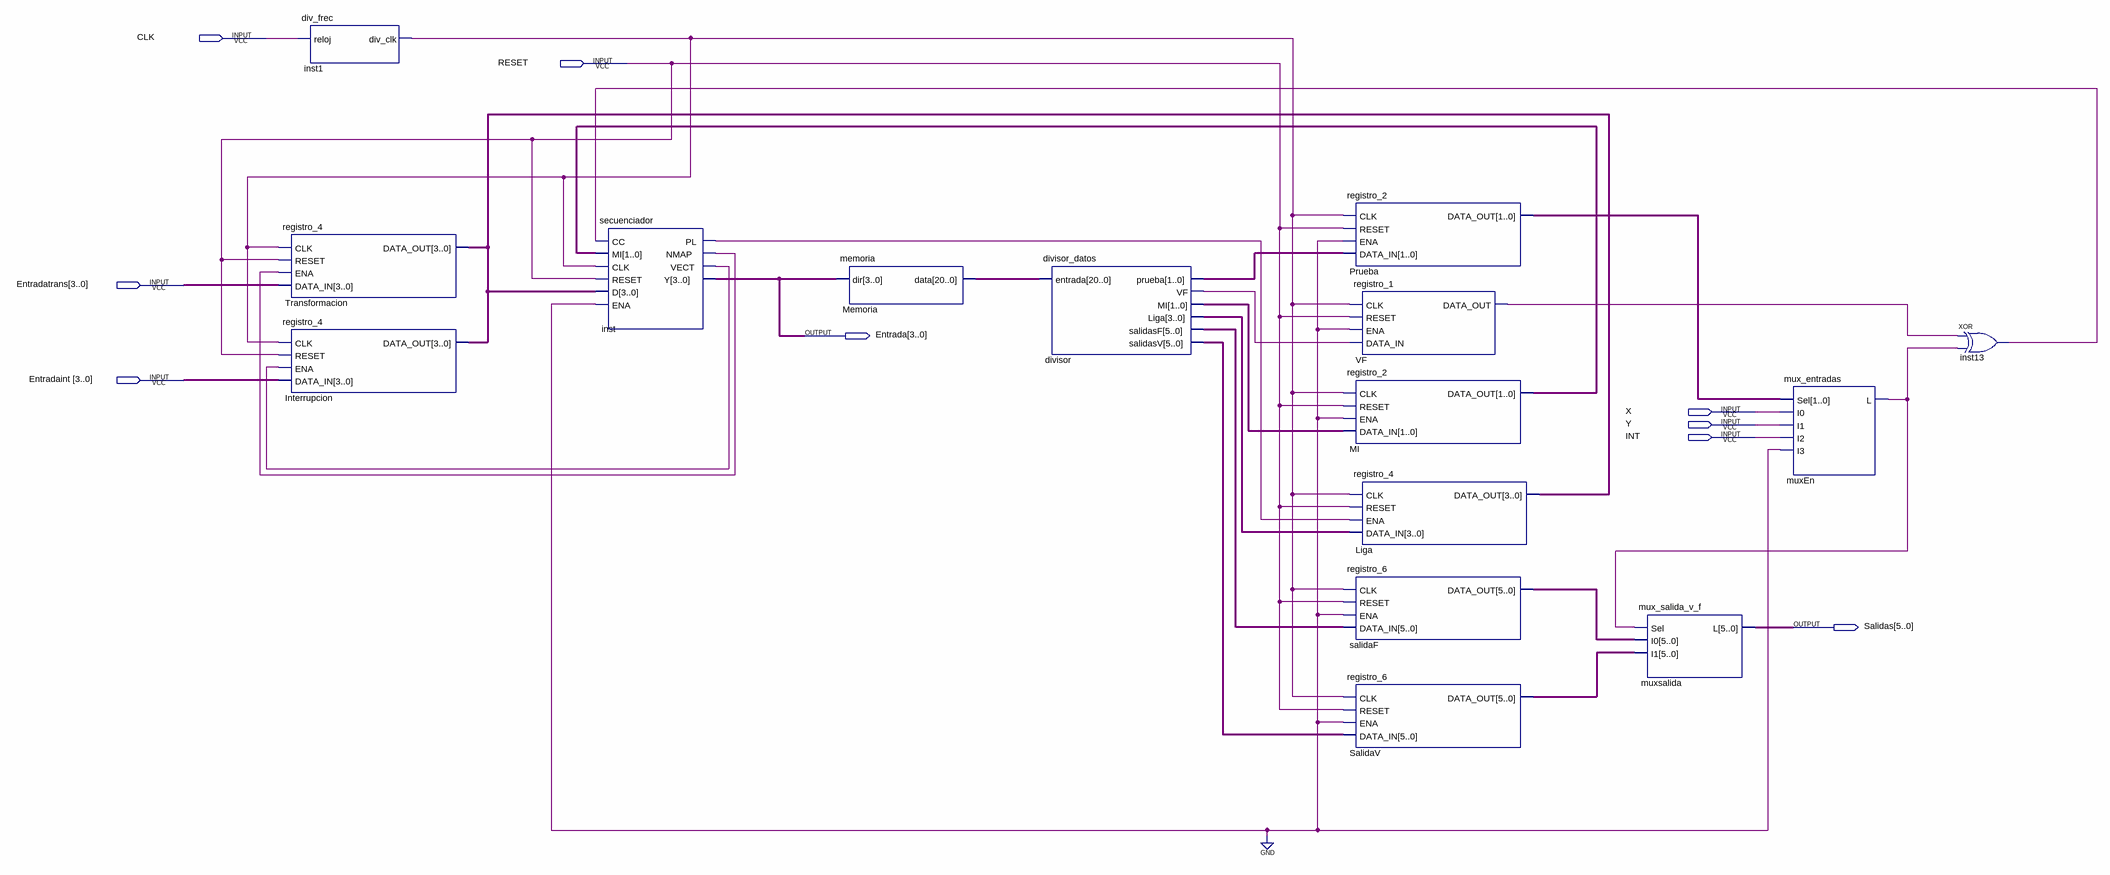
[diagram p0: schematic sheet]
// Quartus schematic Practica6.bdf as structural Verilog: 15 symbols, 9 pins
module Practica6 (
  input  CLK,
  input  RESET,
  input  [3:0] Entradatrans,
  input  [3:0] Entradaint,
  input  X,
  input  Y,
  input  INT,
  output [3:0] Entrada,
  output [5:0] Salidas
);

  wire divisor_vf, inst1_div_clk, inst13_out, inst_nmap, inst_pl, inst_vect, muxEn_l, VF_data_out;
  wire [1:0] divisor_mi, divisor_prueba, MI_data_out, Prueba_data_out;
  wire [3:0] divisor_liga, Transformacion_data_out;
  wire [5:0] divisor_salidasf, divisor_salidasv, salidaF_data_out, SalidaV_data_out;
  wire [20:0] Memoria_data;

  registro_4 Transformacion (
    .CLK(inst1_div_clk), .RESET(RESET), .ENA(inst_nmap), .DATA_IN(Entradatrans),
    .DATA_OUT(Transformacion_data_out));
  registro_4 Interrupcion (
    .CLK(inst1_div_clk), .RESET(RESET), .ENA(inst_vect), .DATA_IN(Entradaint),
    .DATA_OUT(Transformacion_data_out));
  div_frec inst1 (.reloj(CLK), .div_clk(inst1_div_clk));
  secuenciador inst (
    .CC(inst13_out), .MI(MI_data_out), .CLK(inst1_div_clk), .RESET(RESET), .D(Transformacion_data_out),
    .ENA(1'b0), .PL(inst_pl), .NMAP(inst_nmap), .VECT(inst_vect), .Y(Entrada));
  memoria Memoria (.dir(Entrada), .data(Memoria_data));
  divisor_datos divisor (
    .entrada(Memoria_data), .prueba(divisor_prueba), .VF(divisor_vf), .MI(divisor_mi), .Liga(divisor_liga),
    .salidasF(divisor_salidasf), .salidasV(divisor_salidasv));
  registro_2 Prueba (
    .CLK(inst1_div_clk), .RESET(RESET), .ENA(1'b0), .DATA_IN(divisor_prueba), .DATA_OUT(Prueba_data_out));
  registro_1 VF (.CLK(inst1_div_clk), .RESET(RESET), .ENA(1'b0), .DATA_IN(divisor_vf), .DATA_OUT(VF_data_out));
  registro_2 MI (.CLK(inst1_div_clk), .RESET(RESET), .ENA(1'b0), .DATA_IN(divisor_mi), .DATA_OUT(MI_data_out));
  registro_4 Liga (
    .CLK(inst1_div_clk), .RESET(RESET), .ENA(inst_pl), .DATA_IN(divisor_liga),
    .DATA_OUT(Transformacion_data_out));
  registro_6 salidaF (
    .CLK(inst1_div_clk), .RESET(RESET), .ENA(1'b0), .DATA_IN(divisor_salidasf), .DATA_OUT(salidaF_data_out));
  registro_6 SalidaV (
    .CLK(inst1_div_clk), .RESET(RESET), .ENA(1'b0), .DATA_IN(divisor_salidasv), .DATA_OUT(SalidaV_data_out));
  mux_salida_v_f muxsalida (.Sel(muxEn_l), .I0(salidaF_data_out), .I1(SalidaV_data_out), .L(Salidas));
  mux_entradas muxEn (.Sel(Prueba_data_out), .I0(X), .I1(Y), .I2(INT), .I3(1'b0), .L(muxEn_l));
  xor inst13 (inst13_out, VF_data_out, muxEn_l);
endmodule
